# Altium schematic sheet POWER.SchDoc
size A3; SheetNumber: 5; SheetTotal: 5
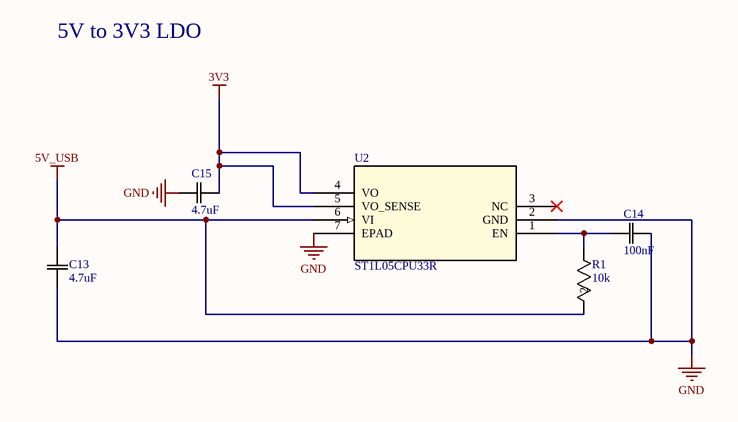
[diagram p0: POWER.SchDoc]

## Parts
C13  4.7uF  [CAP_CL10_SAM]
C14  100nF  [CAPC10555_55N_KEM]
C15  4.7uF  [LMK107_TAY]
R1  10k  [RC0402N_YAG]
U2  ST1L05CPU33R  [DFN6_3X3_STM]

## Nets
3V3: C15.2 U2.4(VO) U2.5(VO_SENSE)
5V_USB: C13.2 R1.2 U2.6(VI)
GND: C13.1 C14.1 C15.1 U2.2(GND) U2.7(EPAD)
NetC14_2: C14.2 R1.1 U2.1(EN)

Not connected (* = marked no-connect by the designer): U2 3(NC)*

## Notes on the sheet
- 5V to 3V3 LDO

## Library data of the parts
C13 = CL10A475MO8NNNC: No Description Available; Manufacturer_Name: Samsung; Copyright: Copyright (C) 2025 Ultra Librarian. All rights reserved.; Manufacturer_Part_Number: CL10A475MO8NNNC
C14 = C0402C104K4RACTU: SMD Comm X7R, Ceramic, 0.1 uF, 10%, 16 VDC, X7R, SMD, MLCC, Temperature Stable, Class II, 0402; Manufacturer_Name: Kemet; Copyright: Copyright (C) 2025 Ultra Librarian. All rights reserved.; Manufacturer_Part_Number: C0402C104K4RACTU
C15 = LMK107BJ475MAHT: No Description Available; Manufacturer_Name: TAIYO YUDEN; Copyright: Copyright (C) 2025 Ultra Librarian. All rights reserved.; Manufacturer_Part_Number: LMK107BJ475MAHT
R1 = RC0402FR-0710KL: RES; SMT (0402); 10K; 1%; +/-100PPM/DEGC; 0.0630W; Manufacturer_Name: Yageo; Copyright: Copyright (C) 2025 Ultra Librarian. All rights reserved.; Manufacturer_Part_Number: RC0402FR-0710KL
U2 = ST1L05CPU33R: Very low quiescent BiCMOS voltage regulator; Manufacturer_Name: STMicroelectronics; Copyright: Copyright (C) 2025 Ultra Librarian. All rights reserved.; Manufacturer_Part_Number: ST1L05CPU33R; RefDes: RefDes; Type: Type